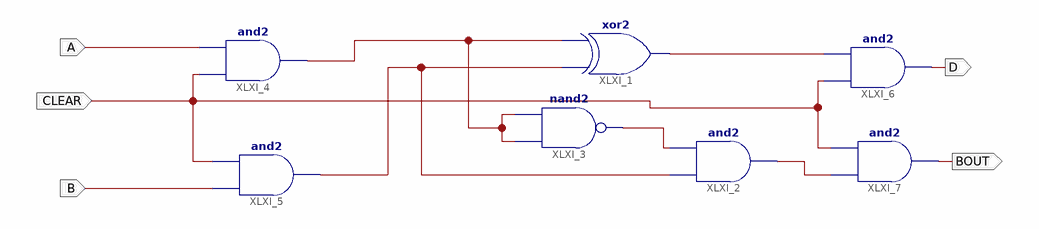
[diagram p0: schematic sheet 1]
// Xilinx ISE schematic halfsubtractor.sch (artix7) as structural Verilog: 7 symbols, 5 ports
module halfsubtractor (
  input  CLEAR,
  input  A,
  input  B,
  output D,
  output BOUT
);

  wire XLXN_3, XLXN_5, XLXN_6, XLXN_17, XLXN_18;

  xor XLXI_1 (XLXN_17, XLXN_3, XLXN_5);
  and XLXI_2 (XLXN_18, XLXN_3, XLXN_6);
  nand XLXI_3 (XLXN_6, XLXN_5, XLXN_5);
  and XLXI_4 (XLXN_5, CLEAR, A);
  and XLXI_5 (XLXN_3, B, CLEAR);
  and XLXI_6 (D, CLEAR, XLXN_17);
  and XLXI_7 (BOUT, XLXN_18, CLEAR);
endmodule
